# Altium project CPU-board-multi.PrjPCB (part 1 of 2)
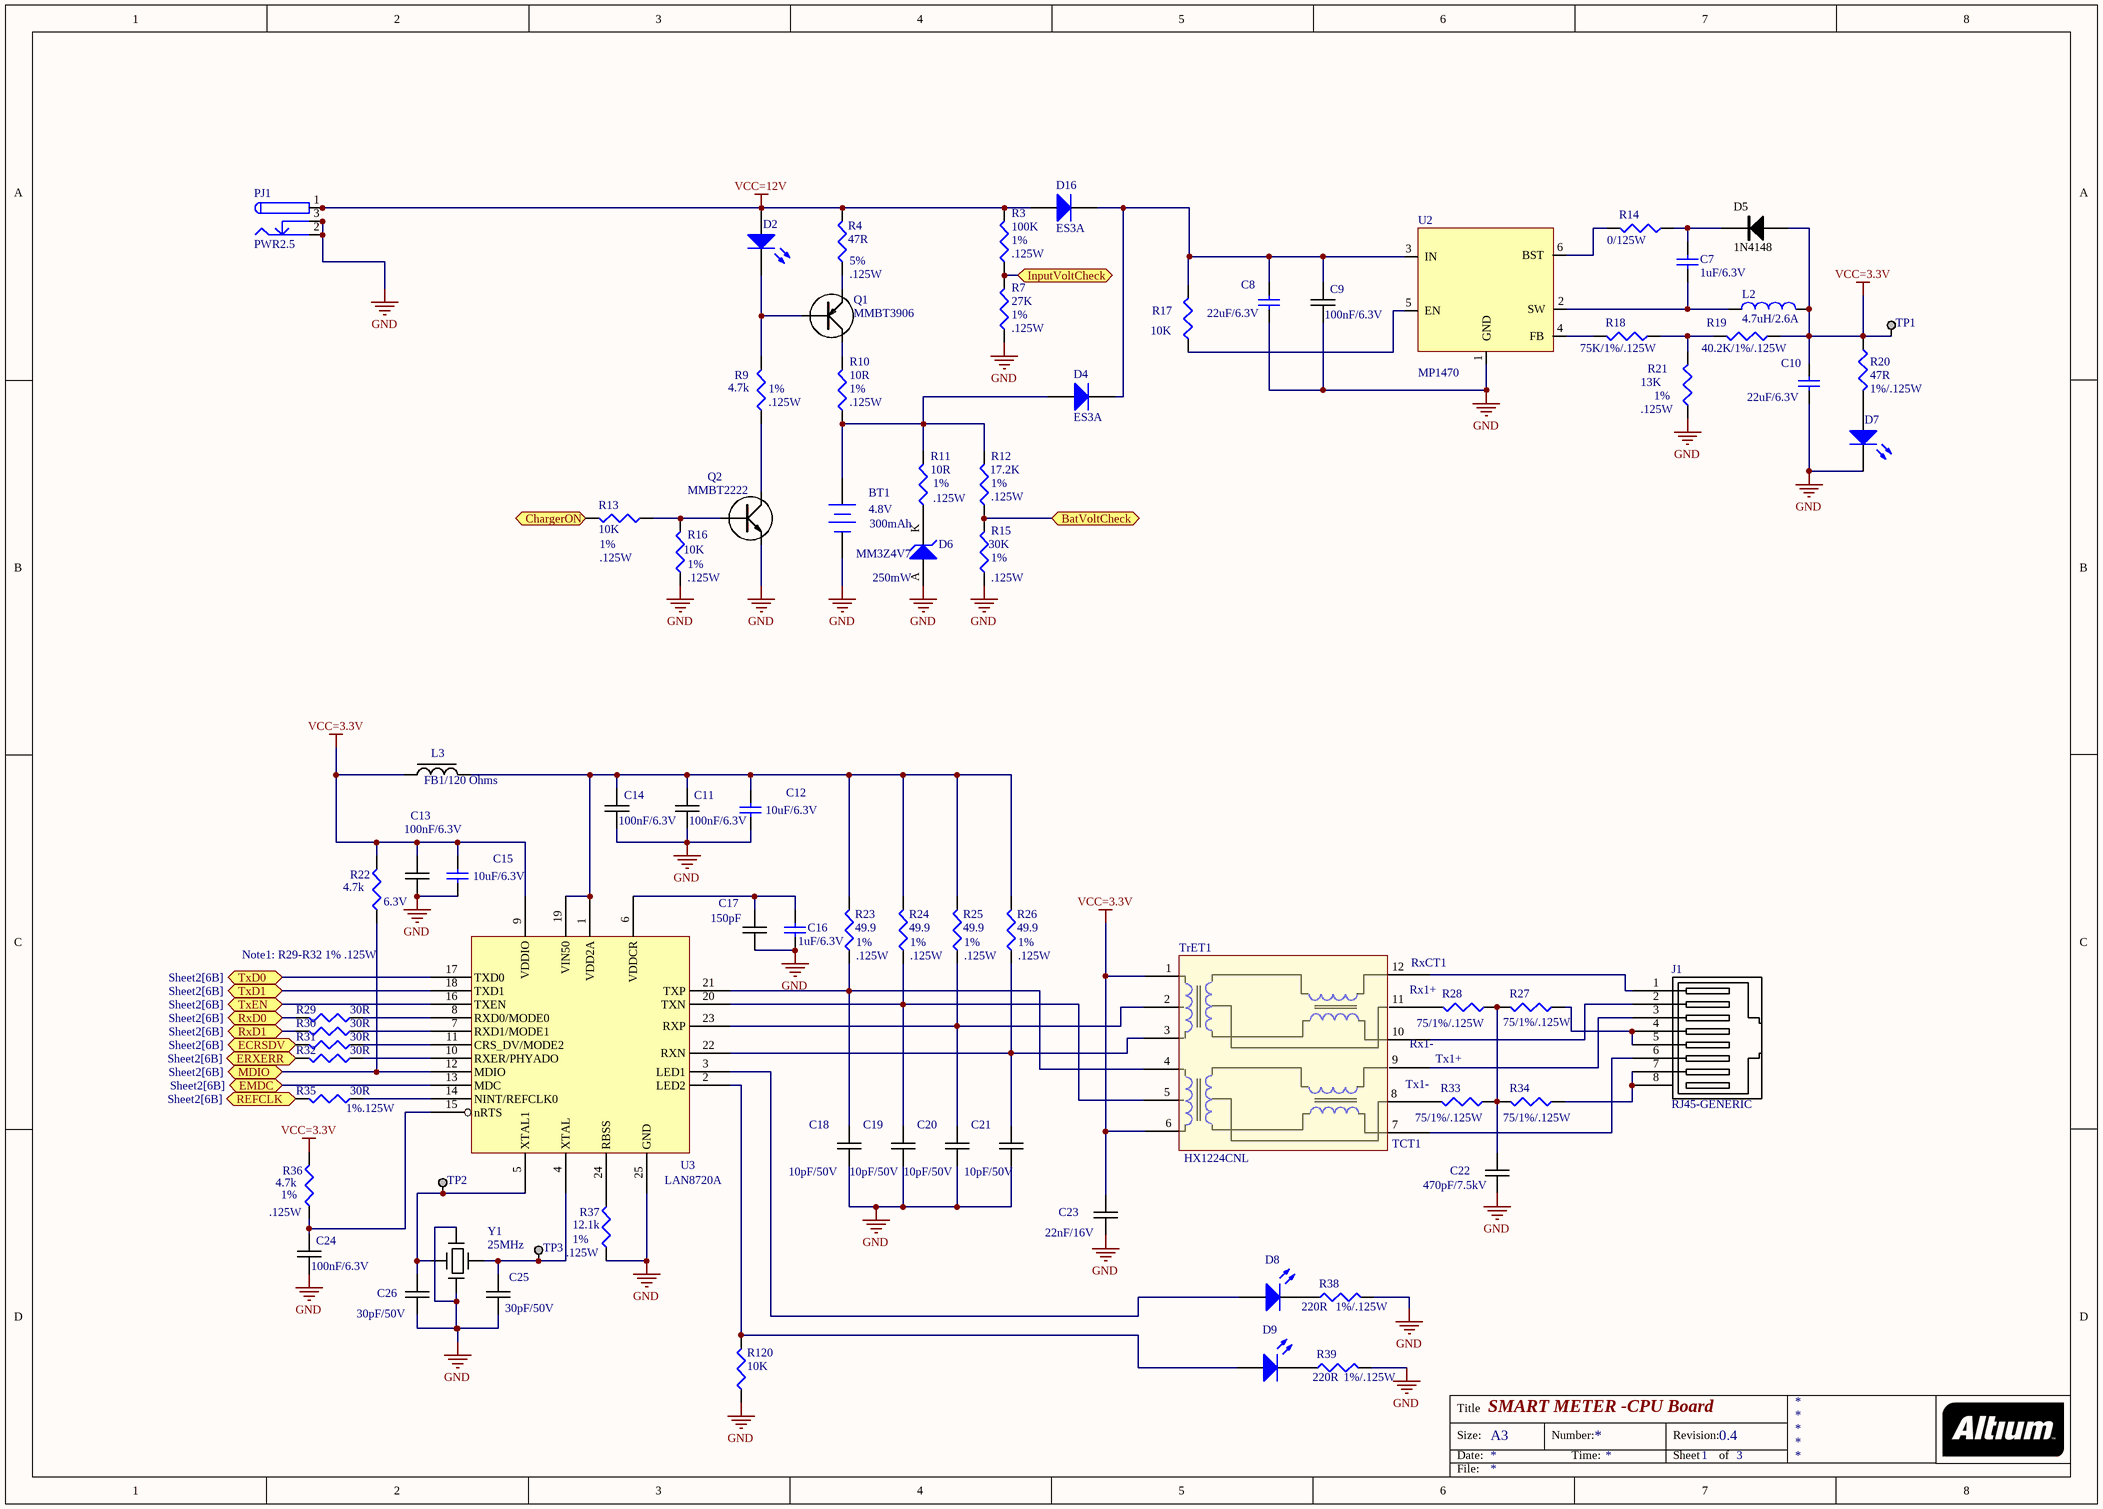
[diagram p0: CPU-board-Sheet1-multi.SchDoc]
3 sheets, 319 parts. Net scope: flat (ports and power ports of the same name join across sheets).
Board file: CPU-board-multi.PcbDoc
Sheets:
  CPU-board-Sheet1-multi.SchDoc
  CPU-board-Sheet2-multi.SchDoc
  CPU-board-Sheet3-multi.SchDoc

## Sheet CPU-board-Sheet1-multi.SchDoc: SMART METER -CPU Board
size A3; Revision: 0.4; SheetNumber: 1; SheetTotal: 3

### Parts
BT1  4.8V  [BAT-2]
C7  1uF/6.3V  [0402C-GENERIC]
C8  22uF/6.3V  [1206C-GENERIC]
C9  100nF/6.3V  [0402C-GENERIC]
C10  22uF/6.3V  [1206C-GENERIC]
C11  100nF/6.3V  [0402C-GENERIC]
C12  10uF/6.3V  [0402C-GENERIC]
C13  100nF/6.3V  [0402C-GENERIC]
C14  100nF/6.3V  [0402C-GENERIC]
C15  10uF/6.3V  [0402C-GENERIC]
C16  1uF/6.3V  [0402C-GENERIC]
C17  150pF  [0402C-GENERIC]
C18  10pF/50V  [0402C-GENERIC]
C19  10pF/50V  [0402C-GENERIC]
C20  10pF/50V  [0402C-GENERIC]
C21  10pF/50V  [0402C-GENERIC]
C22  470pF/7.5kV  [1808]
C23  22nF/16V  [0402C-GENERIC]
C24  100nF/6.3V  [0402C-GENERIC]
C25  30pF/50V  [0402C-GENERIC]
C26  30pF/50V  [0402C-GENERIC]
D2  LED2  [LED-SM]  (value not drawn)
D4  ES3A  [DO214AA]
D5  1N4148  [SOD-123]
D6  MM3Z4V7  [SOT23-DIODE]
D7  LED2  [LED-SM]  (value not drawn)
D8  LED2  [LED-SM]  (value not drawn)
D9  LED2  [LED-SM]  (value not drawn)
D16  ES3A  [DO214AA]
J1  RJ45-GENERIC  [RJ45-8/8]
L2  4.7uH/2.6A  [Inductor 4.7/6.8]
L3  FB1/120 Ohms  [0603C-2U2]
PJ1  PWR2.5  [Female Plug]
Q1  MMBT3906  [SOT23-BCE]
Q2  MMBT2222  [MMBT2222]
R3  100K  [0402R-TBD]
R4  47R  [0402R-TBD]
R7  27K  [0402R-TBD]
R9  4.7k  [0402R-TBD]
R10  10R  [0402R-TBD]
R11  10R  [0402R-TBD]
R12  17.2K  [0402R-TBD]
R13  10K  [0402R-TBD]
R14  0/125W  [0402C-GENERIC]
R15  30K  [0402R-TBD]
R16  10K  [0402R-TBD]
R17  10K  [0402R-TBD]
R18  75K/1%/.125W  [0402C-TBD]
R19  40.2K/1%/.125W  [0402R-TBD]
R20  47R  [0402R-TBD]
R21  13K  [0402R-TBD]
R22  4.7k  [0402R-TBD]
R23  49.9  [0402R-TBD]
R24  49.9  [0402R-TBD]
R25  49.9  [0402R-TBD]
R26  49.9  [0402R-TBD]
R27  75/1%/.125W  [0402R-TBD]
R28  75/1%/.125W  [0402R-TBD]
R29  30R  [0402R-TBD]
R30  30R  [0402R-TBD]
R31  30R  [0402R-TBD]
R32  30R  [0402R-TBD]
R33  75/1%/.125W  [0402R-TBD]
R34  75/1%/.125W  [0402R-TBD]
R35  30R  [0402R-TBD]
R36  4.7k  [0402R-TBD]
R37  12.1k  [0402R-TBD]
R38  220R  [0402R-TBD]
R39  220R  [0402R-TBD]
R120  10K  [0402R-TBD]
TP1  TESTPOINT  [TESTPOINT]  (value not drawn)
TP2  TESTPOINT  [TESTPOINT]  (value not drawn)
TP3  TESTPOINT  [TESTPOINT]  (value not drawn)
TrET1  HX1224CNL  [HX1224-NL]
U2  MP1470  [MP1470]
U3  LAN8720A  [QFN24_4X4_N]
Y1  25MHz  [CeramicResonator8-16MHZ]

### Ports
BatVoltCheck, ChargerON, ECRSDV (see Sheet2[6B]), EMDC (see Sheet2[6B]), ERXERR (see Sheet2[6B]), InputVoltCheck, MDIO (see Sheet2[6B]), REFCLK (see Sheet2[6B]), RxD0 (see Sheet2[6B]), RxD1 (see Sheet2[6B]), TxD0 (see Sheet2[6B]), TxD1 (see Sheet2[6B]), TxEN (see Sheet2[6B])

### Nets
GND: BT1.2(-) C8.2 C9.2 C10.2 C11.2 C12.2 C13.2 C14.2 C15.2 C16.1 C17.2 C18.2 C19.2 C20.2 C21.2 C22.2 C23.2 C24.2 C25.2 C26.2 D6.A D7.2(K) PJ1.2 PJ1.2A PJ1.2B PJ1.3 PJ1.3A PJ1.3B Q2.E R7.1 R15.1 R16.1 R21.1 R37.1 R38.2 R39.2 R120.1 U2.1(GND) U3.25(GND) Y1.2 Y1.4
VCC=3.3V: C10.1 C13.1 C15.1 C23.1 D5.A L2.2 L3.1 R19.1 R20.1 R22.2 R36.2 TP1.1 TrET1.1(TD+) TrET1.6 U3.9(VDDIO)
VCC=12V: D2.1(A) D16.1(A) PJ1.1 PJ1.1A PJ1.1B R3.2 R4.2
NetBT1_1: BT1.1(+) D4.1(A) R10.1 R11.2 R12.2
NetC7_1: C7.1 L2.1 U2.2(SW)
NetC7_2: C7.2 D5.K R14.1
NetC8_1: C8.1 C9.1 D4.2(K) D16.2(K) R17.2 U2.3(IN)
NetC11_1: C11.1 C12.1 C14.1 L3.2 R23.2 R24.2 R25.2 R26.2 U3.1(VDD2A) U3.19(VIN50)
NetC16_2: C16.2 C17.1 U3.6(VDDCR)
NetC18_1: C18.1 R23.1 TrET1.4 U3.21(TXP)
NetC19_1: C19.1 R24.1 TrET1.5 U3.20(TXN)
NetC20_1: C20.1 R25.1 TrET1.2(TDCT) U3.23(RXP)
NetC21_1: C21.1 R26.1 TrET1.3(TD-) U3.22(RXN)
NetC22_1: C22.1 R27.2 R28.1 R33.1 R34.2
NetC24_1: C24.1 R36.1 U3.15(nRTS)
NetC25_1: C25.1 TP3.1 U3.4(XTAL) Y1.1
NetC26_1: C26.1 TP2.1 U3.5(XTAL1) Y1.3
NetD2_2: D2.2(K) Q1.B R9.2
NetD6_K: D6.K R11.1
NetD7_1: D7.1(A) R20.2
NetD8_1: D8.1(A) U3.3(LED1)
NetD8_2: D8.2(K) R38.1
NetD9_1: D9.1(A) R120.2 U3.2(LED2)
NetD9_2: D9.2(K) R39.1
NetJ1_1: J1.1 TrET1.12
NetJ1_2: J1.2 TrET1.10
NetJ1_3: J1.3 TrET1.9
NetJ1_4: J1.4 J1.5 R27.1
NetJ1_6: J1.6 TrET1.7
NetJ1_7: J1.7 J1.8 R34.1
NetQ1_C: Q1.C R10.2
NetQ1_E: Q1.E R4.1
NetQ2_B: Q2.B R13.1 R16.2
NetQ2_C: Q2.C R9.1
NetR3_1: R3.1 R7.2 ; port InputVoltCheck
NetR12_1: R12.1 R15.2 ; port BatVoltCheck
NetR13_2: R13.2 ; port ChargerON
NetR14_2: R14.2 U2.6(BST)
NetR17_1: R17.1 U2.5(EN)
NetR18_1: R18.1 R19.2 R21.2
NetR18_2: R18.2 U2.4(FB)
NetR22_1: R22.1 U3.12(MDIO) ; port MDIO
NetR28_2: R28.2 TrET1.11
NetR29_1: R29.1 U3.8(RXD0/MODE0)
NetR29_2: R29.2 ; port RxD0
NetR30_1: R30.1 U3.7(RXD1/MODE1)
NetR30_2: R30.2 ; port RxD1
NetR31_1: R31.1 U3.11(CRS_DV/MODE2)
NetR31_2: R31.2 ; port ECRSDV
NetR32_1: R32.1 U3.10(RXER/PHYADO)
NetR32_2: R32.2 ; port ERXERR
NetR33_2: R33.2 TrET1.8
NetR35_1: R35.1 U3.14(NINT/REFCLK0)
NetR35_2: R35.2 ; port REFCLK
NetR37_2: R37.2 U3.24(RBSS)
NetU3_13: U3.13(MDC) ; port EMDC
NetU3_16: U3.16(TXEN) ; port TxEN
NetU3_17: U3.17(TXD0) ; port TxD0
NetU3_18: U3.18(TXD1) ; port TxD1

### Notes on the sheet
- (near R3) 1%
- (near R4) 5%
- (near R4) .125W
- (near R3) .125W
- (near R7) 1%
- (near R7) .125W
- (near R9) 1%
- (near R9) .125W
- (near R10) 1%
- (near R10) .125W
- (near R21) .125W
- (near R21) 1%
- (near R20) 1%/.125W
- (near R11) 1%
- (near R11) .125W
- (near R12) 1%
- (near R12) .125W
- (near R13) 1%
- .125W
- (near R16) 1%
- (near R16) .125W
- 300mAh
- (near D6) 250mW
- (near R15) 1%
- (near R15) .125W
- (near R22) 6.3V
- Note1: R29-R32 1% .125W
- (near R23) 1%
- (near R23) .125W
- (near R24) 1%
- (near R24) .125W
- (near R25) 1%
- (near R25) .125W
- (near R26) 1%
- (near R26) .125W
- Rx1+
- RxCT1
- Rx1-
- (near R35) 1%
- (near R35) .125W
- Tx1-
- Tx1+
- (near TrET1) TCT1
- (near R36) .125W
- (near R36) 1%
- (near R37) .125W
- 1%
- (near R38) 1%/.125W
- (near R39) 1%/.125W
- Title
- Size:
- Date:
- A3
- Number:
- Time:
- Revision:
- Sheet
- of
- File:

### Library data of the parts
BT1 = Battery: Multicell Battery; Manufacturer: Guangdong, China (Mainland); Mfr.PN#: 9V-NIMH-01; Published: 24-Mar-1999; LatestRevisionDate: 17-Jul-2002; LatestRevisionNote: Re-released for DXP Platform.; PackageReference: BAT-2; Publisher: sunbangpower.en.alibaba.com; PackageDescription: Battery; 2 Leads; Price: 1; Lik access: *
C7 C16 = Cap: Capacitor; Manufacturer: Murata; Mfr.PN#: GRM155R60J105KE19D; Value: 1uF; Suppl.PN#: 490-1320-1-ND; Published: 8-Jun-2000; LatestRevisionDate: 17-Jul-2002; LatestRevisionNote: Re-released for DXP Platform.; PackageReference: 0402; Publisher: Altium Limited; PackageDescription: Radial Cap, Thru-Hole; 2 Leads; 0.3 in Pin Spacing; Supplier: DigiKey
C8 C10 = Cap: Capacitor; Manufacturer: Murata; Mfr.PN#: GRM31CR60J226KE19L; Value: 100n; Suppl.PN#: 490-1824-2-ND; Published: 8-Jun-2000; LatestRevisionDate: 17-Jul-2002; LatestRevisionNote: Re-released for DXP Platform.; PackageReference: 1206; Publisher: Altium Limited; PackageDescription: Radial Cap, Thru-Hole; 2 Leads; 0.3 in Pin Spacing; Supplier: Digi-Key; Price: .049; Footprint: 0603
C9 C11 C13 C14 C24 = 0805C-18PF-50V-C0G-JOH: CAPACITOR 0805 CERAMIC; mfr PN: LMK105BJ104KV-F; Manufacturer: Taiyo Yuden; Mfr.PN#: CRM155R71H103KA880; Value: 100nF/16V; Suppl.PN#: 587-1227-1-ND; Supplier 1: Digi-Key; Supplier Part Number 1: 709-1171-2-ND; Package reference: 0805-TBD; Supplier: Digi-Key; PackageReference: 0402; Price: .002
C12 C15 = Cap: Capacitor; Manufacturer: Murata; Mfr.PN#: GRM155R60J106ME15D; Suppl.PN#: 490-13238-6-ND; Published: 8-Jun-2000; LatestRevisionDate: 17-Jul-2002; LatestRevisionNote: Re-released for DXP Platform.; PackageReference: 0402; Publisher: Altium Limited; PackageDescription: Radial Cap, Thru-Hole; 2 Leads; 0.3 in Pin Spacing; Value: 10uF/6.3V; Supplier: Digi-Key; Price: .049; Footprint: 0603
C17 = 0805C-18PF-50V-C0G-JOH: CAPACITOR 0805 CERAMIC; Manufacturer: Wurth Electronics; Mfr.PN#: 885012005014; Value: 150pF/10V; Suppl.PN#: 732-7432-1-ND; Supplier 1: Digi-Key; Supplier Part Number 1: 709-1171-2-ND; mfr PN: *; PackageReference: 0402; Supplier: Digi-Key; smd: 0402; Price: .002
C18-C21 = 0805C-18PF-50V-C0G-JOH: CAPACITOR 0805 CERAMIC; Manufacturer: Murata; Mfr.PN#: GRM1555C1H100FA01D; Suppl.PN#: 490-6186-1-ND; Supplier 1: Digi-Key; Supplier Part Number 1: 709-1171-2-ND; Value: 10pF/50V; Supplier: Digi-Key; Price: .03; PackageReference: 0402
C22 = 0805C-18PF-50V-C0G-JOH: CAPACITOR 1808CERAMIC; Manufacturer: Murata; Mfr.PN#: DHRB5AD471M1CB; Value: 470pF; Suppl.PN#: 81-DHRB5AD471M1CB; Supplier 1: Digi-Key; Supplier Part Number 1: 709-1171-2-ND; Supplier: Mouser; PackageReference: 1801; Price: .0096
C23 = 0805C-18PF-50V-C0G-JOH: CAPACITOR 0805 CERAMIC; Manufacturer: Murata Electronics; Mfr.PN#: GRM155R71H223KA12D; Value: 22nF; Suppl.PN#: 490-3884-1-ND; Supplier 1: Digi-Key; Supplier Part Number 1: 709-1171-2-ND; Supplier: 490-5407-6-ND; SMD: 0402; Price: .0096; PackageReference: 0402
C25 C26 = 0805C-18PF-50V-C0G-JOH: CAPACITOR 0805 CERAMIC; Manufacturer: Murata; Mfr.PN#: C0402C300J5GACTU; Suppl.PN#: 399-7785-1-ND; Supplier 1: Digi-Key; Supplier Part Number 1: 709-1171-2-ND; Value: 30pF/50V; Supplier: KEMET; Price: $ 0.34; PackageReference: 0402
D2 D7-D9 = LED2: Typical RED, GREEN, YELLOW, AMBER GaAs LED; Manufacturer: Lite-On Inc; Mfr.PN#: LTST-C191KGKT; Suppl.PN#: 160-1446-2-ND; Published: 8-Jun-2000; LatestRevisionDate: 17-Jul-2002; LatestRevisionNote: Re-released for DXP Platform.; PackageVersion: Feb-2002; PackageReference: 0603; Publisher: Altium Limited; PackageDescription: SM LED; 2 Flat Leads; Supplier: Digi-Key; Price: .04
D4 D16 = Diode 1N4007: 1 Amp General Purpose Rectifier; Manufacturer: Fairchild Co; Suppl.PN#: ES3AFSCT-ND; Published: 8-Jun-2000; LatestRevisionDate: 17-Jul-2002; LatestRevisionNote: Re-released for DXP Platform.; DatasheetVersion: 1998; PackageVersion: Aug-1999; PackageReference: DO-214AC; Publisher: Altium Limited; PackageDescription: Diode, Axial; Body 5.2 x 2.7 mm (LxDia. max), Lead Dia. 0.86 mm (max); Code_JEDEC: DO-204-AL; ComponentLink1Description: Manufacturer Link; ComponentLink1URL: http://www.fairchildsemi.com/; ComponentLink2Description: Datasheet; ComponentLink2URL: http://www.fairchildsemi.com/ds/1N%2F1N4001.pdf; Mfr.PN#: ES3A; Supplier: DigiKey; Price: .142
D5 = 1N4001: Manufacturer: Vishay; Mfr.PN#: 1N4148W-E3-18; Suppl.PN#: 1N4148W-E3-18CT-ND; Supplier: Digikey; PackageReference: SOD-123
D6 = D Zener: Zener Diode; Manufacturer: Fairchild Semi; Mfr.PN#: MM3Z4V7B; Suppl.PN#: MM3Z4V7BCT-ND; Published: 8-Jun-2000; LatestRevisionDate: 17-Jul-2002; LatestRevisionNote: Re-released for DXP Platform.; PackageReference: SOD-323F; Publisher: Altium Limited; PackageDescription: Diode, Thru-Hole; 2 Leads; 0.7 in Pin Spacing; Supplier: DigiKey
J1 = RJ45-GENERIC: GENERIC RJ45 CONNECTOR 8 PIN; Manufacturer: Assman WSW Components; Mfr.PN#: A-2004-2-4-LP-N-R; Suppl.PN#: AE10384-ND; Supplier: DigiKey
L2 = Inductor: Manufacturer: Bourns; Mfr.PN#: SDR7045-6R8M; Code_IEC: 1005; Value: 4.7uH; Suppl.PN#: 490-10791-1-ND; Published: 8-Jun-2000; LatestRevisionDate: 29-May-2009; LatestRevisionNote: IPC-7351 Footprint Added.; PackageReference: 2-SMD; Publisher: Altium Limited; PackageDescription: Chip Inductor; Code_JEITA: 0402; mfr PN: *; Supplier: DigiKey; Price: .82
L3 = 1U-1239AS-TOKO: 1239AS-H-1R0N; Mfr.PN#: BLM18PG121SN1D; Manufacturer: Murata Electronics; Suppl.PN#: 490-1037-1-ND; Supplier: Digi-Key; Price: .288; SMD: look at dsheet; PackageReference: 0603
PJ1 = PWR2.5: Low Voltage Power Supply Connector; Manufacturer: CUI Inc; Mfr.PN#: PJ1-022-SMT-TR; Suppl.PN#: CP1-022PJCT-ND; Published: 17-Dec-2003; DatasheetDocument: 09-May-2002; Publisher: Altium Limited; ComponentLink1Description: Manufacturer Link; ComponentLink1URL: http://domino.kycon.com/internet/Products.html; Supplier: Digikey; Link: http://www.digikey.bg/product-detail/en/cui-inc/PJ1-022-SMT-TR/CP1-022PJCT-ND/659939
Q1 = PNP-GENERIC: GENERIC PNP BIPOLAR TRANSISTOR; Manufacturer: On Semi; Mfr.PN#: MMBT3906LT1G; Suppl.PN#: MMBT3906LT1GOSCT-ND; MMBT3906LT1GOSCT-ND: SOT23-3; Supplier: DigiKey; PackageReference: SOT23-3
Q2 = MMBT2222: BC847 SMALL SIGNAL NPN TRANSISTOR; Manufacturer: Diodes  Inc.; Mfr.PN#: MMBT2222A-7-F; Suppl.PN#: MMBT2222A-FDICT-ND; Supplier 1: Digi-Key; Supplier: Digi-Key; PackageReference: SOT-323; Price: .03
R3 = Res3: Resistor; Manufacturer: Panasonic; Mfr.PN#: ERJ-2RKF1003X; Suppl.PN#: P100KLCT-ND; Published: 8-Jun-2000; LatestRevisionDate: 29-May-2009; LatestRevisionNote: IPC-7351 Footprint Added.; PackageReference: 0402; Publisher: Altium Limited; PackageDescription: Chip Resistor; Value: 100K; Supplier: DigiKey; Price: .0035
R4 = Res3: Resistor; mfr PN: ERJ-2RKF47R0X; Manufacrturer: Panasonic; Mfr.PN#: CRCW080545R0FKTA; Value: 45/.125/1%; Suppl.PN#: P47.0LCT-ND; Published: 8-Jun-2000; LatestRevisionDate: 29-May-2009; LatestRevisionNote: IPC-7351 Footprint Added.; PackageReference: 0402; Publisher: Altium Limited; PackageDescription: Chip Resistor; Supplier: Digi-Key
R7 = Res3: Resistor; Manufacturer: Panasonic; Mfr.PN#: ERJ-2RKF2702X; Suppl.PN#: P27.0KLDKR-ND; Published: 8-Jun-2000; LatestRevisionDate: 29-May-2009; LatestRevisionNote: IPC-7351 Footprint Added.; PackageReference: 0402; Publisher: Altium Limited; PackageDescription: Chip Resistor; Value: 27K; Supplier: DigiKey; Price: .0035
R9 R22 R36 = Res3: Resistor; Manufacturer: Panasonic; Mfr.PN#: ERJ-2RKF4701X; Value: 4.7k/ .125W 1%; Suppl.PN#: P4.70KLCT-ND; Published: 8-Jun-2000; LatestRevisionDate: 29-May-2009; LatestRevisionNote: IPC-7351 Footprint Added.; PackageReference: 0402; Publisher: Altium Limited; PackageDescription: Chip Resistor; Supplier: Digi-Key; Price: .1
R10 R11 = Res3: Resistor; Manufacturer: Panasonic; Mfr.PN#: ERJ-2RKF10R0X; Suppl.PN#: P10.0LDKR-ND; Published: 8-Jun-2000; LatestRevisionDate: 29-May-2009; LatestRevisionNote: IPC-7351 Footprint Added.; PackageReference: 0402; Publisher: Altium Limited; PackageDescription: Chip Resistor; Value: 10R; Supplier: DigiKey; Price: .0035
R12 = Res3: Resistor; Manufacturer: Vishay Dale; Mfr.PN#: TNPW040217K2BEED; Value: 57.6K; Suppl.PN#: 541-2080-2-ND; Published: 8-Jun-2000; LatestRevisionDate: 29-May-2009; LatestRevisionNote: IPC-7351 Footprint Added.; PackageReference: 0402; Publisher: Altium Limited; PackageDescription: Chip Resistor; Supplier: DigiKey; Price: .0035
R13 R16 R17 = Res3: Resistor; Manufacturer: Panasonic; Mfr.PN#: ERJ-2RKF1002X; Value: 100K; Suppl.PN#: P10.0KLTR-ND; Published: 8-Jun-2000; LatestRevisionDate: 29-May-2009; LatestRevisionNote: IPC-7351 Footprint Added.; PackageReference: 0402; Publisher: Altium Limited; PackageDescription: Chip Resistor; Supplier: Digi-Key; Price: .0035
R14 = Res3: Resistor; Manufacturer: Vishay Dale; Mfr.PN#: RCA0805100KFKEA; Value: 100K; Suppl.PN#: 541-2230-1-ND; Published: 8-Jun-2000; LatestRevisionDate: 29-May-2009; LatestRevisionNote: IPC-7351 Footprint Added.; PackageReference: 0402; Publisher: Altium Limited; PackageDescription: Chip Resistor; Supplier: Digi-Key; Price: .0035
R15 = Res3: Resistor; Manufacturer: Panasonic; Mfr.PN#: ERJ-2RKF3002X; Value: 33K; Published: 8-Jun-2000; LatestRevisionDate: 29-May-2009; LatestRevisionNote: IPC-7351 Footprint Added.; PackageReference: 0402; Publisher: Altium Limited; PackageDescription: Chip Resistor; Supplier: DigiKey; Price: .0035
R18 = Res3: Resistor; Manufacturer: Panasonic; Mfr.PN#: ERJ-2GEJ753X; Value: 75K; Suppl.PN#: P75KJDKR-ND; Published: 8-Jun-2000; LatestRevisionDate: 29-May-2009; LatestRevisionNote: IPC-7351 Footprint Added.; PackageReference: 0402; Publisher: Altium Limited; PackageDescription: Chip Resistor; Supplier: Digikey; Price: .0035
R19 = Res3: Resistor; Manufacturer: Panasonic; Mfr.PN#: ERJ-2RKF4022X; Value: 100K; Suppl.PN#: P40.2KLCT-ND; Published: 8-Jun-2000; LatestRevisionDate: 29-May-2009; LatestRevisionNote: IPC-7351 Footprint Added.; PackageReference: 0402; Publisher: Altium Limited; PackageDescription: Chip Resistor; Supplier: DigiKey; Price: .0035
R20 = Res3: Resistor; mfr PN: ERJ-2RKF47R0X; Manufacrturer: Panasonic; Mfr.PN#: ERJ-6ENF47R0V; Value: 45/.125/1%; Suppl.PN#: P47.0LCT-ND; Published: 8-Jun-2000; LatestRevisionDate: 29-May-2009; LatestRevisionNote: IPC-7351 Footprint Added.; PackageReference: 0402; Publisher: Altium Limited; PackageDescription: Chip Resistor; Supplier: Digi-Key
R21 = Res3: Resistor; Manufacturer: Panasonic; Mfr.PN#: ERJ-2RKF1302X; Suppl.PN#: P13.0KLCT-ND; Published: 8-Jun-2000; LatestRevisionDate: 29-May-2009; LatestRevisionNote: IPC-7351 Footprint Added.; PackageReference: 0402; Publisher: Altium Limited; PackageDescription: Chip Resistor; Value: 13K; Supplier: DigiKey; Price: .0035
R23-R26 = Res3: Resistor; Manufacturer: Panasonic; Mfr.PN#: ERJ-2RKF49R9X; Value: 49.9 .125W 1%; Suppl.PN#: P49.9LCT-ND; Published: 8-Jun-2000; LatestRevisionDate: 29-May-2009; LatestRevisionNote: IPC-7351 Footprint Added.; PackageReference: 0402; Publisher: Altium Limited; PackageDescription: Chip Resistor; Supplier: Digi-Key; Price: .0026
R27 R28 R33 R34 = Res3: Resistor; Manufacturer: Panasonic; Mfr.PN#: ERJ-2RKF75R0X; Value: 75 1% .125; Suppl.PN#: P75.0LCT-ND; Published: 8-Jun-2000; LatestRevisionDate: 29-May-2009; LatestRevisionNote: IPC-7351 Footprint Added.; PackageReference: 0402; Publisher: Altium Limited; PackageDescription: Chip Resistor; Supplier: Digi-Key; Price: .0026
R29-R32 R35 = Res3: Resistor; Manufacturer: Panasonic; Mfr.PN#: ERJ-2RKF30R0X; Value: 100 .125W 1%; Suppl.PN#: P30.0LCT-ND; Published: 8-Jun-2000; LatestRevisionDate: 29-May-2009; LatestRevisionNote: IPC-7351 Footprint Added.; PackageReference: 0402; Publisher: Altium Limited; PackageDescription: Chip Resistor; Supplier: Digi-Key; Price: .1
R37 = Res3: Resistor; Manufacturer: Panasonic; Mfr.PN#: ERJ-2RKF1212X; Value: 12.1k/ .125W 1%; Suppl.PN#: P12.1KLCT-ND; Published: 8-Jun-2000; LatestRevisionDate: 29-May-2009; LatestRevisionNote: IPC-7351 Footprint Added.; PackageReference: 0402; Publisher: Altium Limited; PackageDescription: Chip Resistor; Supplier: Digi-Key; Price: .1
R38 R39 = Res3: Resistor; Manufacturer: Panasonic; Mfr.PN#: ERJ-2RKF1001X; Value: 1K; Suppl.PN#: P1.00KLCT-ND; Published: 8-Jun-2000; LatestRevisionDate: 29-May-2009; LatestRevisionNote: IPC-7351 Footprint Added.; PackageReference: 0402; Publisher: Altium Limited; PackageDescription: Chip Resistor; Supplier: DigiKey; Price: .0035
R120 = Res3: Resistor; Manufacturer: Panasonic; Mfr.PN#: ERJ-2GEJ103X; Value: 10K .125W 1%; Suppl.PN#: P10KJCT-ND; Published: 8-Jun-2000; LatestRevisionDate: 29-May-2009; LatestRevisionNote: IPC-7351 Footprint Added.; PackageReference: 0402; Publisher: Altium Limited; PackageDescription: Chip Resistor; Supplier: Digi-Key; Price: .0026
TP1-TP3 = TESTPOINT: TESTPOINT SCOPE GRABBER; Manufacturer Part Number: 5010; Manufacturer: Keystone Electronics; Reel: TH; Supplier 1: Digi-Key; Supplier Part Number 1: 5010K-ND
TrET1 = hx1224nl: Manufacturer: Pulse Electronic Corporation; Suppl.PN#: HX1224CNL-ND; Mfr.PN#: HX1224CNL; Supplier: DigiKey
U2 = MP1470: Manufacturer: MPS Inc; Mfr.PN#: MP1470GJ-P; Suppl.PN#: 1589-1018-1-ND; Supplier: DigiKey; PackageReference: TSOT-23-6
U3 = LAN8720: Manufacturer: Microchip; Mfr.PN#: LAN8720A-CP-TR; Suppl.PN#: LAN8720A-CP-CT-ND; Supplier: Digi-key; Price: .76; PackageReference: 24 QFN
Y1 = 12MC-HC49US-7MM: 25MHz CRYSTAL HC49US SHORT BODY; Manufacturer: KDS DAISHINKU.Corp; Mfr.PN#: DSX321SH-25MHz; Supplier 1: Mouser; Supplier Part Number 1: 520-120-20-3XT; Link access: www.kds.info/product; Supplier: KDS DAISHINKU.Corp; Suppl.PN#: DSX321SH-25MHz

## Sheet CPU-board-Sheet2-multi.SchDoc: SM-CPU Board
size A3; Revision: rev. 0.1; SheetNumber: 2
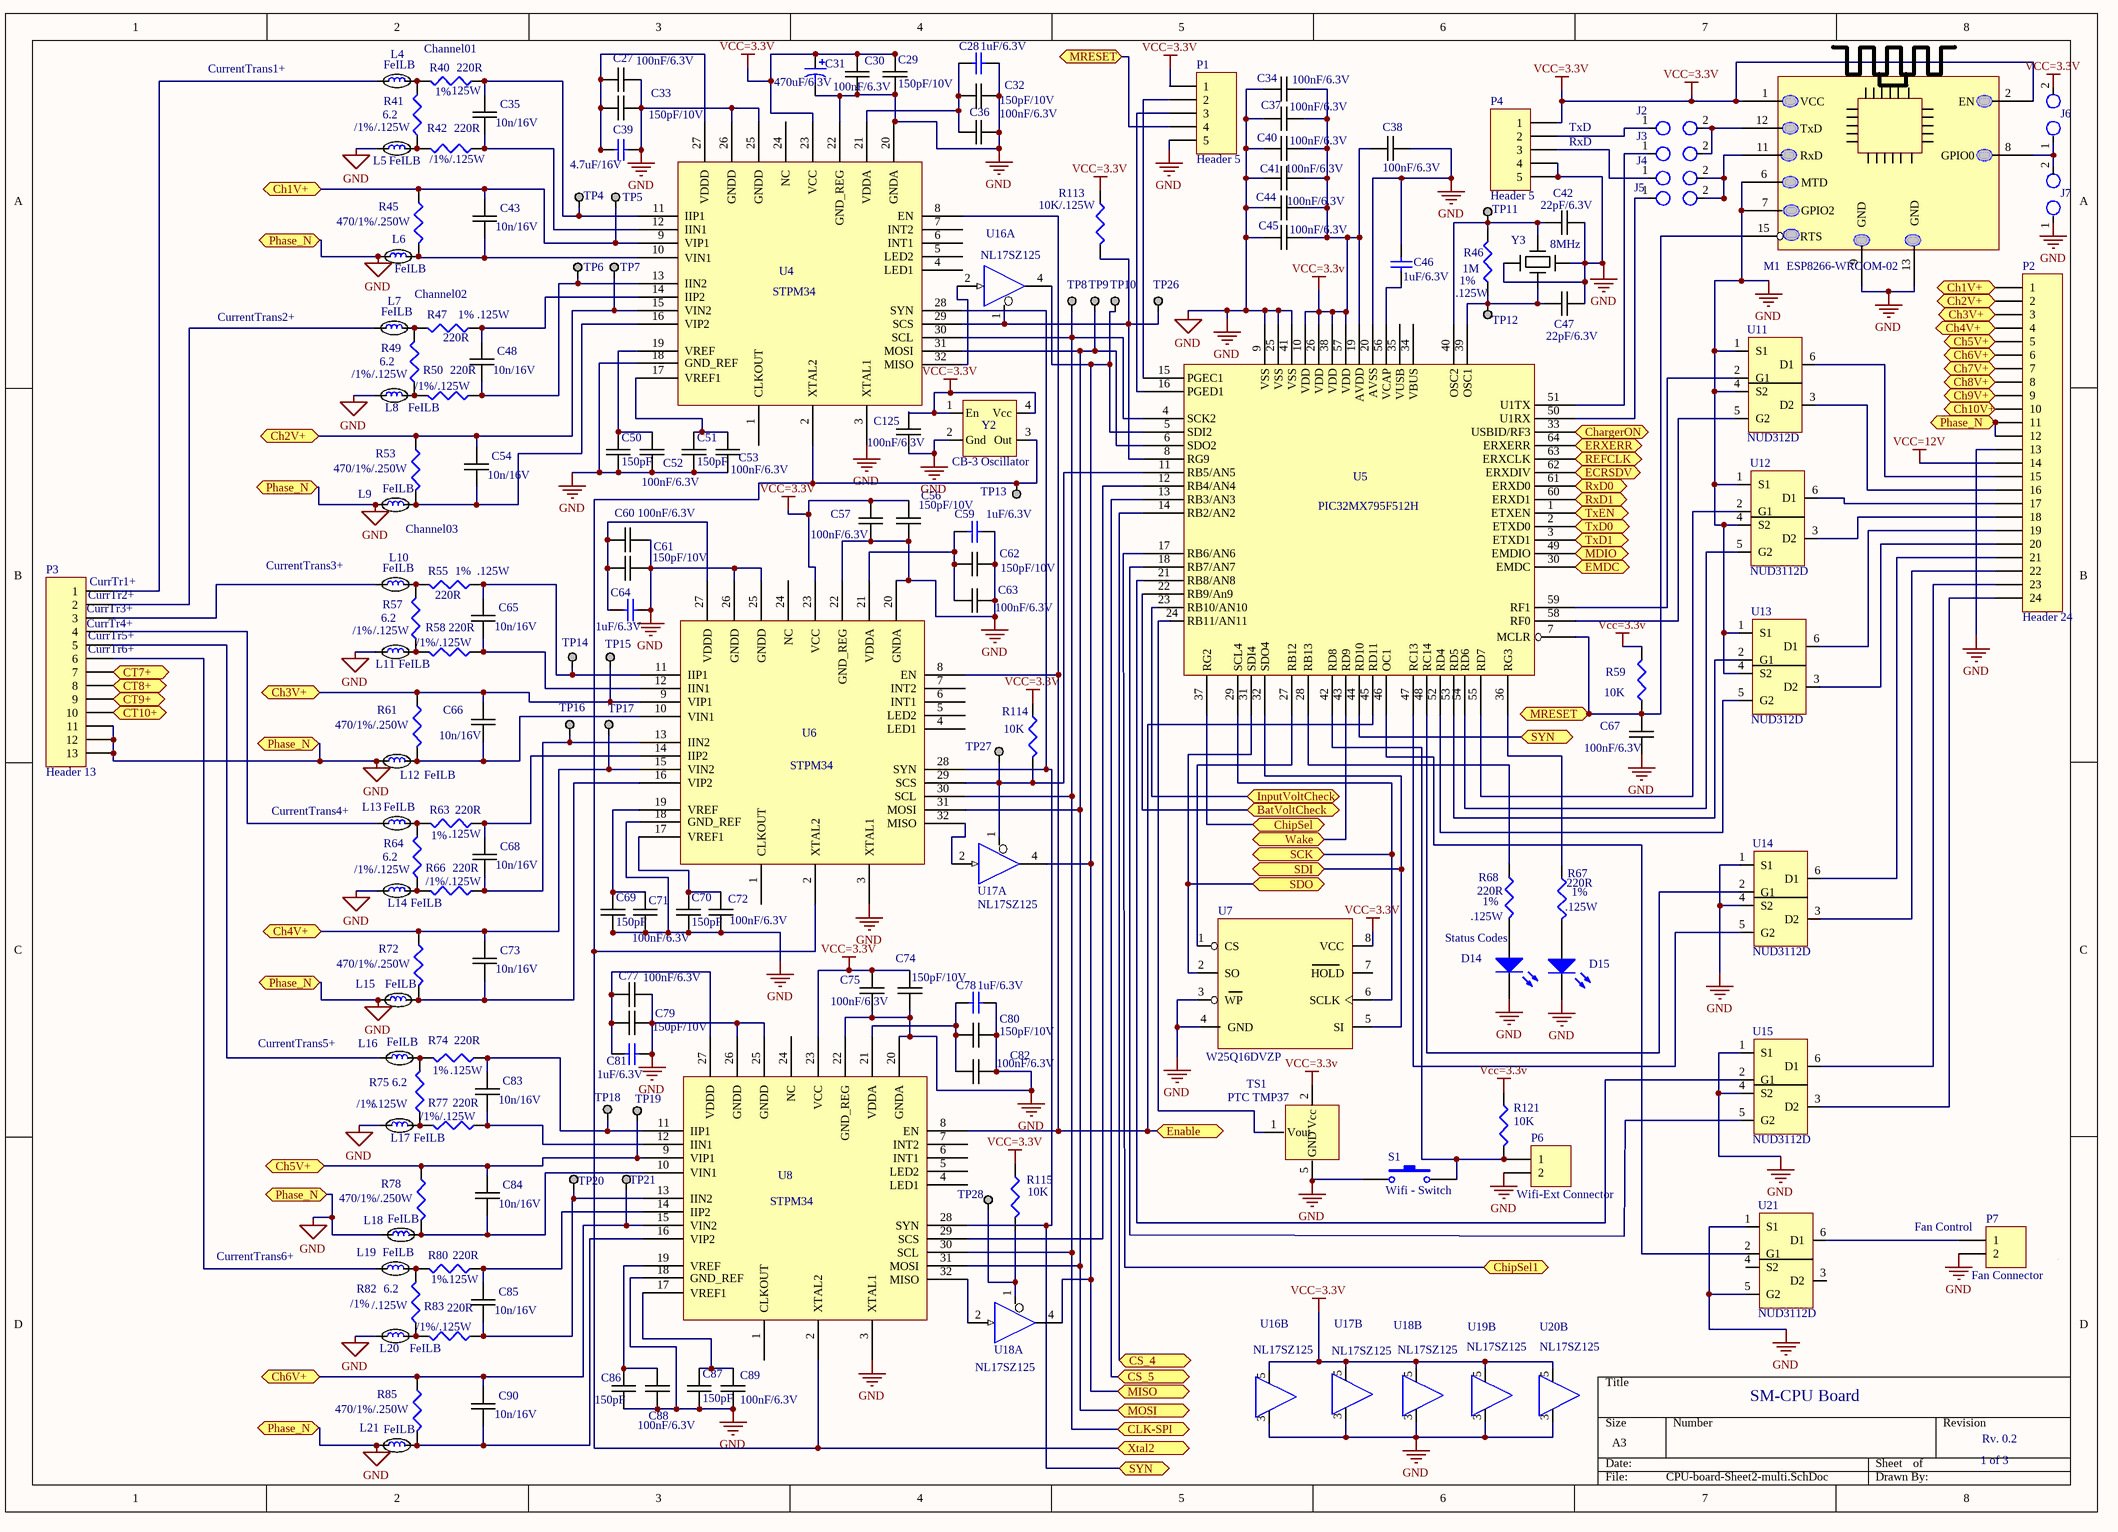
[diagram p1: CPU-board-Sheet2-multi.SchDoc]

### Parts
(Parts that share a designator on the sheet are numbered #1, #2 ... from top to bottom, then left to right.)
C27  100nF/6.3V  [0402C-GENERIC]
C28  1uF/6.3V  [0402C-GENERIC]
C29  150pF/10V  [0402C-GENERIC]
C30  100nF/6.3V  [0402C-GENERIC]
C31  470uF/6.3V  [470uF/6.3v]
C32  150pF/10V  [0402C-GENERIC]
C33  150pF/10V  [0402C-GENERIC]
C34  100nF/6.3V  [0402C-GENERIC]
C35  10n/16V  [0402C-GENERIC]
C36  100nF/6.3V  [0402C-GENERIC]
C37  100nF/6.3V  [0402C-GENERIC]
C38  100nF/6.3V  [0402C-GENERIC]
C39  4.7uF/16V  [0402C-GENERIC]
C40  100nF/6.3V  [0402C-GENERIC]
C41  100nF/6.3V  [0402C-GENERIC]
C42  22pF/6.3V  [0402C-GENERIC]
C43  10n/16V  [0402C-GENERIC]
C44  100nF/6.3V  [0402C-GENERIC]
C45  100nF/6.3V  [0402C-GENERIC]
C46  1uF/6.3V  [0402C-GENERIC]
C47  22pF/6.3V  [0402C-GENERIC]
C48  10n/16V  [0402C-GENERIC]
C50  150pF  [0402C-GENERIC]
C51  150pF  [0402C-GENERIC]
C52  100nF/6.3V  [0402C-GENERIC]
C53  100nF/6.3V  [0402C-GENERIC]
C54  10n/16V  [0402C-GENERIC]
C56  150pF/10V  [0402C-GENERIC]
C57  100nF/6.3V  [0402C-GENERIC]
C59  1uF/6.3V  [0402C-GENERIC]
C60  100nF/6.3V  [0402C-GENERIC]
C61  150pF/10V  [0402C-GENERIC]
C62  150pF/10V  [0402C-GENERIC]
C63  100nF/6.3V  [0402C-GENERIC]
C64  1uF/6.3V  [0402C-GENERIC]
C65  10n/16V  [0402C-GENERIC]
C66  10n/16V  [0402C-GENERIC]
C67  100nF/6.3V  [0402C-GENERIC]
C68  10n/16V  [0402C-GENERIC]
C69  150pF  [0402C-GENERIC]
C70  150pF  [0402C-GENERIC]
C71  100nF/6.3V  [0402C-GENERIC]
C72  100nF/6.3V  [0402C-GENERIC]
C73  10n/16V  [0402C-GENERIC]
C74  150pF/10V  [0402C-GENERIC]
C75  100nF/6.3V  [0402C-GENERIC]
C77  100nF/6.3V  [0402C-GENERIC]
C78  1uF/6.3V  [0402C-GENERIC]
C79  150pF/10V  [0402C-GENERIC]
C80  150pF/10V  [0402C-GENERIC]
C81  1uF/6.3V  [0402C-GENERIC]
C82  100nF/6.3V  [0402C-GENERIC]
C83  10n/16V  [0402C-GENERIC]
C84  10n/16V  [0402C-GENERIC]
C85  10n/16V  [0402C-GENERIC]
C86  150pF  [0402C-GENERIC]
C87  150pF  [0402C-GENERIC]
C88  100nF/6.3V  [0402C-GENERIC]
C89  100nF/6.3V  [0402C-GENERIC]
C90  10n/16V  [0402C-GENERIC]
C125  100nF/6.3V  [0402C-GENERIC]
D14  LED2  [LED-SM]  (value not drawn)
D15  LED2  [LED-SM]  (value not drawn)
J2  Header1x1  [HDR1X2]  (value not drawn)
J3  Header1x1  [HDR1X2]  (value not drawn)
J4  Header1x1  [HDR1X2]  (value not drawn)
J5  Header1x1  [HDR1X2]  (value not drawn)
J6  Header1x1  [HDR1X2]  (value not drawn)
J7  Header1x1  [HDR1X2]  (value not drawn)
L4  FeILB  [0603C-TBD]
L5  FeILB  [0603C-TBD]
L6  FeILB  [0603C-TBD]
L7  FeILB  [0603C-TBD]
L8  FeILB  [0603C-TBD]
L9  FeILB  [0603C-TBD]
L10  FeILB  [0603C-TBD]
L11  FeILB  [0603C-TBD]
L12  FeILB  [0603C-TBD]
L13  FeILB  [0603C-TBD]
L14  FeILB  [0603C-TBD]
L15  FeILB  [0603C-TBD]
L16  FeILB  [0603C-TBD]
L17  FeILB  [0603C-TBD]
L18  FeILB  [0603C-TBD]
L19  FeILB  [0603C-TBD]
L20  FeILB  [0603C-TBD]
L21  FeILB  [0603C-TBD]
M1  ESP8266-WROOM-02  [PCBComponent_1 - duplicate]
P1  Header 5  [HDR1X5]
P2  Header 24  [HDR1X24]
P3  Header 13
P4  Header 5  [HDR1X5]
P6  Wifi-Ext Connector  [HDR1X2]
P7  Fan Connector  [HDR1X2]
R40  220R  [0402R-TBD]
R41  6.2  [0402R-TBD]
R42  220R  [0402R-TBD]
R45  470/1%/.250W  [1206FB-GENERIC]
R46  1M  [0402R-TBD]
R47  220R  [0402R-TBD]
R49  6.2  [0402R-TBD]
R50  220R  [0402R-TBD]
R53  470/1%/.250W  [1206FB-GENERIC]
R55  220R  [0402R-TBD]
R57  6.2  [0402R-TBD]
R58  220R  [0402R-TBD]
R59  10K  [0402R-TBD]
R61  470/1%/.250W  [1206FB-GENERIC]
R63  220R  [0402R-TBD]
R64  6.2  [0402R-TBD]
R66  220R  [0402R-TBD]
R67  220R  [0402R-TBD]
R68  220R  [0402R-TBD]
R72  470/1%/.250W  [1206FB-GENERIC]
R74  220R  [0402R-TBD]
R75  6.2  [0402R-TBD]
R77  220R  [0402R-TBD]
R78  470/1%/.250W  [1206FB-GENERIC]
R80  220R  [0402R-TBD]
R82  6.2  [0402R-TBD]
R83  220R  [0402R-TBD]
R85  470/1%/.250W  [1206FB-GENERIC]
R113  10K/.125W  [0402C-GENERIC]
R114  10K  [0402C-GENERIC]
R115  10K  [0402C-GENERIC]
R121  10K  [0402R-TBD]
S1  Wifi - Switch  [SPST-2]
TP4  TESTPOINT  [TESTPOINT]  (value not drawn)
TP5  TESTPOINT  [TESTPOINT]  (value not drawn)
TP6  TESTPOINT  [TESTPOINT]  (value not drawn)
TP7  TESTPOINT  [TESTPOINT]  (value not drawn)
TP8  TESTPOINT  [TESTPOINT]  (value not drawn)
TP9  TESTPOINT  [TESTPOINT]  (value not drawn)
TP10  TESTPOINT  [TESTPOINT]  (value not drawn)
TP11#1  TESTPOINT  [TESTPOINT]  (value not drawn)
TP12  TESTPOINT  [TESTPOINT]  (value not drawn)
TP13  TESTPOINT  [TESTPOINT]  (value not drawn)
TP14  TESTPOINT  [TESTPOINT]  (value not drawn)
TP15  TESTPOINT  [TESTPOINT]  (value not drawn)
TP16  TESTPOINT  [TESTPOINT]  (value not drawn)
TP17#1  TESTPOINT  [TESTPOINT]  (value not drawn)
TP18  TESTPOINT  [TESTPOINT]  (value not drawn)
TP19  TESTPOINT  [TESTPOINT]  (value not drawn)
TP20  TESTPOINT  [TESTPOINT]  (value not drawn)
TP21#1  TESTPOINT  [TESTPOINT]  (value not drawn)
TP26  TESTPOINT  [TESTPOINT]  (value not drawn)
TP27  TESTPOINT  [TESTPOINT]  (value not drawn)
TP28  TESTPOINT  [TESTPOINT]  (value not drawn)
TS1  PTC TMP37
U4  STPM34  [QFN32_L]
U5  PIC32MX795F512H  [QFN64_N]
U6  STPM34  [QFN32_L]
U7  W25Q16DVZP  [SO8_L]
U8  STPM34  [QFN32_L]
U11  NUD312D  [NUD3112D]
U12  NUD3112D  [NUD3112D]
U13  NUD312D  [NUD3112D]
U14  NUD3112D  [NUD3112D]
U15  NUD3112D  [NUD3112D]
U16  NL17SZ125  (parts A,B of 2)
U17  NL17SZ125  (parts A,B of 2)
U18  NL17SZ125  (parts A,B of 2)
U19  NL17SZ125  (part B of 2)
U20  NL17SZ125  (part B of 2)
U21  NUD3112D  [NUD3112D]
Y2  CB-3 Oscillator  [CB3-16MHZ]
Y3  8MHz  [CeramicResonator8-16MHZ]

### Ports
BatVoltCheck, Ch1V+, Ch2V+, Ch3V+, Ch4V+, Ch5V+, Ch6V+, Ch7V+, Ch8V+, Ch9V+, Ch10V+, ChargerON, ChipSel, ChipSel1, CLK-SPI, CS_4, CS_5, CT7+, CT8+, CT9+, CT10+, ECRSDV, EMDC, Enable, ERXERR, InputVoltCheck, MDIO, MISO, MOSI, MRESET, Phase_N, REFCLK, RxD0, RxD1, SCK, SDI, SDO, SYN, TxD0, TxD1, TxEN, Wake, Xtal2

### Nets
GND: C27.2 C28.2 C29.2 C30.2 C31.2 C32.2 C33.2 C34.1 C36.2 C37.1 C38.2 C39.2 C40.1 C41.1 C42.2 C44.1 C45.1 C46.2 C47.2 C50.2 C51.2 C52.1 C53.2 C56.2 C57.2 C59.2 C60.2 C61.2 C62.2 C63.2 C64.2 C67.2 C69.2 C70.2 C71.2 C72.2 C74.2 C75.2 C77.2 C78.2 C79.2 C80.2 C81.2 C82.2 C86.2 C87.2 C88.2 C89.2 C125.1 D14.2(K) D15.2(K) J7.1 L5.1 L6.1 L8.1 L9.1 L11.1 L12.1 L14.1 L15.1 L17.1 L18.1 L20.1 L21.1 M1.6(MTD) M1.7(GPIO2) M1.9(GND) M1.13(GND) P1.5 P2.11 P2.12 P2.13 P3.11 P3.12 P3.13 P4.4 P4.5 P6.2 P7.2 S1.1 TS1.5(GND) U4.3(XTAL1) U4.18(GND_REF) U4.20(GNDA) U4.22(GND_REG) U4.25(GNDD) U4.26(GNDD) U5.9(VSS) U5.20(AVSS) U5.25(VSS) U5.41(VSS) U6.3(XTAL1) U6.18(GND_REF) U6.20(GNDA) U6.22(GND_REG) U6.25(GNDD) U6.26(GNDD) U7.3(WP) U7.4(GND) U8.3(XTAL1) U8.18(GND_REF) U8.20(GNDA) U8.22(GND_REG) U8.25(GNDD) U8.26(GNDD) U11.1(S1) U11.4(S2) U12.1(S1) U12.4(S2) U13.1(S1) U13.4(S2) U14.1(S1) U14.4(S2) U15.1(S1) U15.4(S2) U16.3 U17.3 U18.3 U19.3 U20.3 U21.1(S1) U21.5(G2) Y2.2(Gnd) Y3.2 Y3.4 ; port Phase_N
VCC=3.3V: C29.1 C30.1 C31.1 C34.2 C37.2 C38.1 C40.2 C41.2 C44.2 C45.2 C56.1 C57.1 C74.1 C75.1 C125.2 J6.2 M1.1(VCC) M1.2(EN) P1.1 P4.1 R59.2 R113.1 R114.1 R115.1 R121.1 TS1.2(Vcc) U4.23(VCC) U5.10(VDD) U5.19(AVDD) U5.26(VDD) U5.38(VDD) U5.57(VDD) U6.23(VCC) U7.8(VCC) U8.23(VCC) U16.5 U17.5 U18.5 U19.5 U20.5 Y2.1(En) Y2.4(Vcc)
VCC=12V: P2.14
NetC27_1: C27.1 C33.1 C39.1 U4.27(VDDD)
NetC28_1: C28.1 C32.1 C36.1 U4.21(VDDA)
NetC35_1: C35.1 R42.1 U4.12(IIN1)
NetC35_2: C35.2 R40.1 TP4.1 U4.11(IIP1)
NetC42_1: C42.1 R46.2 TP11#1.1 U5.40(OSC2) Y3.1
NetC43_1: C43.1 L6.2 R45.2 U4.10(VIN1)
NetC43_2: C43.2 P2.1 R45.1 TP5.1 U4.9(VIP1) ; port Ch1V+
NetC46_1: C46.1 U5.56(VCAP)
NetC47_1: C47.1 R46.1 TP12.1 U5.39(OSC1) Y3.3
NetC48_1: C48.1 R50.1 TP6.1 U4.13(IIN2)
NetC48_2: C48.2 R47.1 U4.14(IIP2)
NetC50_1: C50.1 C52.2 U4.19(VREF)
NetC51_1: C51.1 C53.1 U4.17(VREF1)
NetC54_1: C54.1 L9.2 R53.2 U4.16(VIP2)
NetC54_2: C54.2 P2.2 R53.1 TP7.1 U4.15(VIN2) ; port Ch2V+
NetC59_1: C59.1 C62.1 C63.1 U6.21(VDDA)
NetC60_1: C60.1 C61.1 C64.1 U6.27(VDDD)
NetC65_1: C65.1 R58.1 U6.12(IIN1)
NetC65_2: C65.2 R55.1 TP14.1 U6.11(IIP1)
NetC66_1: C66.1 L12.2 R61.2 U6.10(VIN1)
NetC66_2: C66.2 P2.3 R61.1 TP15.1 U6.9(VIP1) ; port Ch3V+
NetC67_1: C67.1 M1.15(RTS) P1.4 R59.1 U5.7(MCLR) ; port MRESET
NetC68_1: C68.1 R66.1 TP16.1 U6.13(IIN2)
NetC68_2: C68.2 R63.1 U6.14(IIP2)
NetC69_1: C69.1 C71.1 U6.19(VREF)
NetC70_1: C70.1 C72.1 U6.17(VREF1)
NetC73_1: C73.1 L15.2 R72.2 U6.16(VIP2)
NetC73_2: C73.2 P2.4 R72.1 TP17#1.1 U6.15(VIN2) ; port Ch4V+
NetC77_1: C77.1 C79.1 C81.1 U8.27(VDDD)
NetC78_1: C78.1 C80.1 C82.1 U8.21(VDDA)
NetC83_1: C83.1 R77.1 U8.12(IIN1)
NetC83_2: C83.2 R74.1 TP18.1 U8.11(IIP1)
NetC84_1: C84.1 L18.2 R78.2 U8.10(VIN1)
NetC84_2: C84.2 P2.5 R78.1 TP19.1 U8.9(VIP1) ; port Ch5V+
NetC85_1: C85.1 R83.1 TP20.1 U8.13(IIN2)
NetC85_2: C85.2 R80.1 U8.14(IIP2)
NetC86_1: C86.1 C88.1 U8.19(VREF)
NetC87_1: C87.1 C89.1 U8.17(VREF1)
NetC90_1: C90.1 L21.2 R85.2 U8.16(VIP2)
NetC90_2: C90.2 P2.6 R85.1 TP21#1.1 U8.15(VIN2) ; port Ch6V+
NetC101_2: P2.7 ; port Ch7V+
NetC103_2: P2.8 ; port Ch8V+
NetC118_2: P2.9 ; port Ch9V+
NetC120_2: P2.10 ; port Ch10V+
NetD14_1: D14.1(A) R68.2
NetD15_1: D15.1(A) R67.2
NetJ2_1: J2.1 P4.2
NetJ2_2: J2.2 J3.2 M1.12(TxD)
NetJ3_1: J3.1 U5.51(U1TX)
NetJ4_1: J4.1 P4.3
NetJ4_2: J4.2 J5.2 M1.11(RxD)
NetJ5_1: J5.1 U5.50(U1RX)
NetJ6_1: J6.1 J7.2 M1.8(GPIO0)
NetL4_1: L4.1 P3.1
NetL4_2: L4.2 R40.2 R41.2
NetL5_2: L5.2 R41.1 R42.2
NetL7_1: L7.1 P3.2
NetL7_2: L7.2 R47.2 R49.2
NetL8_2: L8.2 R49.1 R50.2
NetL10_1: L10.1 P3.3
NetL10_2: L10.2 R55.2 R57.2
NetL11_2: L11.2 R57.1 R58.2
NetL13_1: L13.1 P3.4
NetL13_2: L13.2 R63.2 R64.2
NetL14_2: L14.2 R64.1 R66.2
NetL16_1: L16.1 P3.5
NetL16_2: L16.2 R74.2 R75.2
NetL17_2: L17.2 R75.1 R77.2
NetL19_1: L19.1 P3.6
NetL19_2: L19.2 R80.2 R82.2
NetL20_2: L20.2 R82.1 R83.2
NetL22_1: P3.7 ; port CT7+
NetL25_1: P3.8 ; port CT8+
NetL28_1: P3.9 ; port CT9+
NetM2_3: U5.43(RD9) ; port Wake
NetM2_5: U5.32(SDO4) U7.5(SI) ; port SDI
NetM2_6: U5.29(SCL4) U7.6(SCLK) ; port SCK
NetM2_7: U5.31(SDI4) U7.2(SO) ; port SDO
NetM2_8: U5.17(RB6/AN6) ; port ChipSel1
NetP1_2: P1.2 U5.15(PGEC1)
NetP1_3: P1.3 U5.16(PGED1)
NetP2_15: P2.15 U11.6(D1)
NetP2_16: P2.16 U11.3(D2)
NetP2_17: P2.17 U12.6(D1)
NetP2_18: P2.18 U12.3(D2)
NetP2_19: P2.19 U13.6(D1)
NetP2_20: P2.20 U13.3(D2)
NetP2_21: P2.21 U14.6(D1)
NetP2_22: P2.22 U14.3(D2)
NetP2_23: P2.23 U15.6(D1)
NetP2_24: P2.24 U15.3(D2)
NetP3_10: P3.10 ; port CT10+
NetP6_1: P6.1 R121.2 S1.2 U5.42(RD8)
NetP7_1: P7.1 U21.6(D1)
NetR3_1: U5.23(RB10/AN10) ; port InputVoltCheck
NetR12_1: U5.22(RB9/An9) ; port BatVoltCheck
NetR13_2: U5.33(USBID/RF3) ; port ChargerON
NetR22_1: U5.49(EMDIO) ; port MDIO
NetR29_2: U5.61(ERXD0) ; port RxD0
NetR30_2: U5.60(ERXD1) ; port RxD1
NetR31_2: U5.62(ERXDIV) ; port ECRSDV
NetR32_2: U5.64(ERXERR) ; port ERXERR
NetR35_2: U5.63(ERXCLK) ; port REFCLK
NetR67_1: R67.1 U5.36(RG3)
NetR68_1: R68.1 U5.28(RB13)
NetR113_2: R113.2 TP26.1 U4.29(SCS) U5.8(RG9) U16.1
NetR114_2: R114.2 TP27.1 U5.11(RB5/AN5) U6.29(SCS) U17.1
NetR115_2: R115.2 TP28.1 U18.1
NetR116_2: U5.14(RB2/AN2) ; port CS_4
NetR117_2: U5.13(RB3/AN3) ; port CS_5
NetTP8_1: TP8.1 U4.30(SCL) U5.4(SCK2) U6.30(SCL) U8.30(SCL) ; port CLK-SPI
NetTP9_1: TP9.1 U4.31(MOSI) U5.6(SDO2) U6.31(MOSI) U8.31(MOSI) ; port MOSI
NetTP10_1: TP10.1 U5.5(SDI2) U16.4(Y) U17.4(Y) U18.4(Y) ; port MISO
NetTP13_1: TP13.1 U4.2(XTAL2) U6.2(XTAL2) U8.2(XTAL2) Y2.3(Out) ; port Xtal2
NetTS1_1: TS1.1(Vout) U5.24(RB11/AN11)
NetU3_13: U5.30(EMDC) ; port EMDC
NetU3_16: U5.1(ETXEN) ; port TxEN
NetU3_17: U5.2(ETXD0) ; port TxD0
NetU3_18: U5.3(ETXD1) ; port TxD1
NetU4_8: U4.8(EN) U6.8(EN) U8.8(EN) ; port Enable
NetU4_28: U4.28(SYN) U5.44(RD10) U6.28(SYN) U8.28(SYN) ; port SYN
NetU4_32: U4.32(MISO) U16.2(B)
NetU5_12: U5.12(RB4/AN4) U8.29(SCS)
NetU5_18: U5.18(RB7/AN7) U15.5(G2)
NetU5_21: U5.21(RB8/AN8) U15.2(G1)
NetU5_27: U5.27(RB12) U7.1(CS)
NetU5_37: U5.37(RG2) ; port ChipSel
NetU5_46: U5.46(OC1) U21.2(G1)
NetU5_47: U5.47(RC13) U14.5(G2)
NetU5_48: U5.48(RC14) U14.2(G1)
NetU5_52: U5.52(RD4) U13.5(G2)
NetU5_53: U5.53(RD5) U13.2(G1)
NetU5_54: U5.54(RD6) U12.5(G2)
NetU5_55: U5.55(RD7) U12.2(G1)
NetU5_58: U5.58(RF0) U11.5(G2)
NetU5_59: U5.59(RF1) U11.2(G1)
NetU6_32: U6.32(MISO) U17.2(B)
NetU8_32: U8.32(MISO) U18.2(B)

Not connected (* = marked no-connect by the designer): U4 1(CLKOUT) 4(LED1) 5(LED2) 6(INT1) 7(INT2) 24(NC); U5 34(VBUS) 35(VUSB) 45(RD11); U6 1(CLKOUT) 4(LED1) 5(LED2) 6(INT1) 7(INT2) 24(NC); U7 7(HOLD); U8 1(CLKOUT) 4(LED1) 5(LED2) 6(INT1) 7(INT2) 24(NC); U21 3(D2) 4(S2)

### Notes on the sheet
- Channel01
- CurrentTrans1+
- (near R40) 1%
- (near R40) .125W
- (near L5) /1%
- /.125W
- (near R42) /1%/.125W
- (near P4) TxD
- (near P4) RxD
- CurrentTrans2+
- Channel02
- (near R47) 1%
- (near R47) .125W
- (near R46) .125W
- (near R46) 1%
- (near L8) /1%
- /1%/.125W
- (near P3) CurrTr1+
- (near L10) CurrentTrans3+
- (near L9) Channel03
- (near R55) 1%
- (near R55) .125W
- (near P3) CurrTr3+
- (near P3) CurrTr4+
- (near P3) CurrTr2+
- (near P3) CurrTr5+
- (near P3) CurrTr6+
- (near L11) /1%
- (near L13) CurrentTrans4+
- 1%
- .125W
- (near L14) /1%
- (near R66) /1%/.125W
- (near R68) .125W
- (near R68) 1%
- (near R67) .125W
- (near R67) 1%
- Status Codes
- CurrentTrans5+
- (near L17) /1%
- CurrentTrans6+
- (near P7) Fan Control
- /1%
- (near R82) /.125W
- (near R80) 1%
- SM-CPU Board
- 1 of 3
- Rv. 0.2

### Library data of the parts
C27 C30 C34 C36-C38 C40 C41 C44 C45 C52 C53 C57 C60 C63 C67 C71 C72 C75 C77 C82 C88 C89 C125 = 0805C-18PF-50V-C0G-JOH: as C9 on sheet CPU-board-Sheet1-multi; Supplier 1: Digi-Key; Supplier Part Number 1: 709-1171-2-ND; Package reference: 0805-TBD; Supplier: Digi-Key; PackageReference: 0402; Price: .002
C28 C46 C59 C64 C78 C81 = Cap: as C7 on sheet CPU-board-Sheet1-multi; Published: 8-Jun-2000; LatestRevisionDate: 17-Jul-2002; LatestRevisionNote: Re-released for DXP Platform.; PackageReference: 0402; Publisher: Altium Limited; PackageDescription: Radial Cap, Thru-Hole; 2 Leads; 0.3 in Pin Spacing; Supplier: DigiKey
C29 C32 C33 C56 C61 C62 C74 C79 C80 = 0805C-18PF-50V-C0G-JOH: CAPACITOR 0805 CERAMIC; Manufacturer: Wurth Electronics; Mfr.PN#: 885012005014; Suppl.PN#: 732-7432-1-ND; Supplier 1: Digi-Key; Supplier Part Number 1: 709-1171-2-ND; Value: 150pF/10V; mfr PN: *; Supplier: Digi-Key; Price: .002
  C29 C33: PackageReference: 0402; smd: 0402
  C32: Package reference: 0805-TBD; smd: 0402
  C56 C61 C62 C74 C79 C80: Package reference: 0805-TBD; PackageReference: 0402
C31 = Cap Pol3: Polarized Capacitor (Surface Mount); Manufacturer: Nichicon; Mfr.PN#: RL80J471MDNASQKX; Value: 100uF/10v; Suppl.PN#: 493-4019-3-ND; Published: 8-Jun-2000; LatestRevisionDate: 29-May-2009; LatestRevisionNote: IPC-7351 Footprint Added.; PackageReference: Radial Can; Publisher: Altium Limited; PackageDescription: Chip Capacitor; Supplier: Digi-Key; SMD: 1206; Price: .065
C35 C43 C48 C54 C65 C66 C68 C73 C83-C85 C90 = 0805C-18PF-50V-C0G-JOH: CAPACITOR 0805 CERAMIC; Manufacturer: Murata Electronics; Mfr.PN#: GRM155R71C103KA01D; Value: 10n; Suppl.PN#: 490-1313-1-ND; Supplier 1: Digi-Key; Supplier Part Number 1: 709-1171-2-ND; mfr PN: *; PackageReference: 0402; Supplier: Digi-Key; Price: .002
  C35 C68 C73 C83-C85 C90: Suppl.PN#: GRM155R71C103KA01D; smd: 0402
  C43 C48 C54 C66: Package reference: 0402; Suppl.PN#: GRM155R71C103KA01D
  C65: Package reference: 0805-TBD
C39 = Cap: Capacitor; Manufacturer: Samsung; Mfr.PN#: CL05A475MO5NUNC; Value: 1uF; Suppl.PN#: 1276-6836-1-ND; Published: 8-Jun-2000; LatestRevisionDate: 17-Jul-2002; LatestRevisionNote: Re-released for DXP Platform.; PackageReference: 0402; Publisher: Altium Limited; PackageDescription: Radial Cap, Thru-Hole; 2 Leads; 0.3 in Pin Spacing; Supplier: DigiKey
C42 = 0805C-18PF-50V-C0G-JOH: CAPACITOR 0805 CERAMIC; Manufacturer: Murata; Mfr.PN#: GRM1555C1E120JA01D; Suppl.PN#: 490-8170-1-ND; Supplier 1: Digi-Key; Supplier Part Number 1: 709-1171-2-ND; Supplier: DigiKey; PackageReference: 0402
C47 = 0805C-18PF-50V-C0G-JOH: CAPACITOR 0805 CERAMIC; Manufacturer: Murata; Mfr.PN#: GRM1555C1E120JA01D; Suppliier: DigiKey; Suppl.PN#: 490-8170-1-ND; Supplier 1: Digi-Key; Supplier Part Number 1: 709-1171-2-ND; PackageReference: 0402
C50 C51 C69 C70 C86 C87 = 0805C-18PF-50V-C0G-JOH: as C17 on sheet CPU-board-Sheet1-multi; Supplier 1: Digi-Key; Supplier Part Number 1: 709-1171-2-ND; mfr PN: *; PackageReference: 0402; Supplier: Digi-Key; smd: 0402; Price: .002
D14 D15 = LED2: as D2 on sheet CPU-board-Sheet1-multi; Published: 8-Jun-2000; LatestRevisionDate: 17-Jul-2002; LatestRevisionNote: Re-released for DXP Platform.; PackageVersion: Feb-2002; PackageReference: 0603; Publisher: Altium Limited; PackageDescription: SM LED; 2 Flat Leads; Supplier: Digi-Key; Price: .04
J2-J7 = Header1x1: Suppl.PN#: S9014E-05-ND; Supplier: Digikey
L4-L21 = FerrBeads/ILBB: Manufacturer: Brand Samsung; Mfr.PN#: C1M10J152NC; Suppl.PN#: 1276-6326-1-ND; Supplier: Digi-Key; Price: .027
  L4-L7: PackageReference: 0603
M1 = ESP 8266: Supplier: Alixpress; Suppl.PN#: ESP8266-WROOM-02; Link: https://www.aliexpress.com/store/product/ESP8266-serial-WIFI-model-ESP-WROOM-02-Authenticity-Guaranteed/431798_32319251013.html
P1 P4 = Header 5: Header, 5-Pin; Suppl.PN#: S9014E-05-ND; LatestRevisionDate: 17-Jul-2002; LatestRevisionNote: Re-released for DXP Platform.; Publisher: Altium Limited; Supplier: Optional depend of debugger; Supplier: Digikey
P2 = Header 24: Header, 24-Pin; Manufacturer: Sullins Connector Solution; Mfr.PN#: PPPC241LFBN-RC; Suppl.PN#: S7057-ND; LatestRevisionDate: 17-Jul-2002; LatestRevisionNote: Re-released for DXP Platform.; Publisher: Altium Limited; Supplier: Digikey
P3 = Header 13: Header, 13-Pin; Mfr.PN#: PPPC131LFBN-RC; Manufacturer: Sullins Connector Solution; Suppl.PN#: S7046-ND; LatestRevisionNote: Re-released for DXP Platform.; Publisher: Altium Limited; Supplier: Digikey
P6 P7 = Header 2: Header, 2-Pin; Suppl.PN#: S9014E-05-ND; LatestRevisionDate: 17-Jul-2002; LatestRevisionNote: Re-released for DXP Platform.; Publisher: Altium Limited; Supplier: Digikey
R40 R42 R47 R50 R55 R58 R63 R66-R68 R74 R77 R80 R83 = Res3: as R38 on sheet CPU-board-Sheet1-multi; Published: 8-Jun-2000; LatestRevisionDate: 29-May-2009; LatestRevisionNote: IPC-7351 Footprint Added.; PackageReference: 0402; Publisher: Altium Limited; PackageDescription: Chip Resistor; Supplier: DigiKey; Price: .0035
R41 R49 R57 R64 R75 R82 = Res3: Resistor; Manufacturer: Vishay Dale; Mfr.PN#: CRCW04026R20FKED; Value: 18.7 1%; Suppl.PN#: 541-6.20LLCT-ND; Published: 8-Jun-2000; LatestRevisionDate: 29-May-2009; LatestRevisionNote: IPC-7351 Footprint Added.; PackageReference: 0402; Publisher: Altium Limited; PackageDescription: Chip Resistor; Supplier: Digi-Key; Price: .05; SMD: 0402
R45 R53 R61 R72 R78 R85 = Res3: Resistor; Manufacturer: Vishay/Draloric; Mfr.PN#: SMM02040C4700FB300; Value: 470 1%/.250W; Suppl.PN#: 71-SMM0204-F-470; Published: 8-Jun-2000; LatestRevisionDate: 29-May-2009; LatestRevisionNote: IPC-7351 Footprint Added.; Publisher: Altium Limited; PackageDescription: Chip Resistor; Supplier: Mouser; SMD: 1206; Price: .02; PackageReference: 1206
R46 = Res3: Resistor; Manufacturer: Panasonic; Mfr.PN#: ERJ-2RKF1004X; Value: 1K 1%; Suppl.PN#: P1.00MLTR-ND; Published: 8-Jun-2000; LatestRevisionDate: 29-May-2009; LatestRevisionNote: IPC-7351 Footprint Added.; PackageReference: 0402; Publisher: Altium Limited; PackageDescription: Chip Resistor; manufacture P/N: *; Supplier: Digi-Key; Price: .0027
R59 R121 = Res3: as R13 on sheet CPU-board-Sheet1-multi; Published: 8-Jun-2000; LatestRevisionDate: 29-May-2009; LatestRevisionNote: IPC-7351 Footprint Added.; PackageReference: 0402; Publisher: Altium Limited; PackageDescription: Chip Resistor; Supplier: Digi-Key; Price: .0035
R113 = Res3: Resistor; Manufacturer: Panasonic; Mfr.PN#: ERJ-2RKF1002X; Value: 10k; Suppl.PN#: P10.0KLCT-ND; Published: 8-Jun-2000; LatestRevisionDate: 29-May-2009; LatestRevisionNote: IPC-7351 Footprint Added.; Publisher: Altium Limited; PackageDescription: Chip Resistor; Supplier: Digikey; SMD: 0402; Price: .02; PackageReference: 0402
R114 = Res3: Resistor; Manufacturer: Panasonic; Mfr.PN#: ERJ-2RKF1002X; Suppl.PN#: P10.0KLCT-ND; Published: 8-Jun-2000; LatestRevisionDate: 29-May-2009; LatestRevisionNote: IPC-7351 Footprint Added.; Publisher: Altium Limited; PackageDescription: Chip Resistor; Value: 10k; Supplier: Digikey; SMD: 0402; Price: .02; PackageReference: 0402
R115 = Res3: Resistor; Manufacturer: Panasonic; Mfr.PN#: ERJ-2RKF1002X; Value: 10k/1%/.125W; Suppl.PN#: P10.0KLCT-ND; Published: 8-Jun-2000; LatestRevisionDate: 29-May-2009; LatestRevisionNote: IPC-7351 Footprint Added.; Publisher: Altium Limited; PackageDescription: Chip Resistor; Supplier: Digikey; SMD: 0402; Price: .02; PackageReference: 0402
S1 = SW-PB: Switch; Manufacturer: Digibay; Mfr.PN#: SE-DE01-09-0157; Published: 24-Mar-1999; LatestRevisionDate: 17-Jul-2002; LatestRevisionNote: Re-released for DXP Platform.; PackageReference: SPST-2; Publisher: Altium Limited; PackageDescription: Switch; 2 Leads; Link: http://www.digibay.in/157-smd-tactile-micro-push-button-switch
TP4-TP10 TP11#1 TP12-TP16 TP17#1 TP18-TP20 TP21#1 TP26-TP28 = TESTPOINT: as TP1 on sheet CPU-board-Sheet1-multi; Supplier 1: Digi-Key; Supplier Part Number 1: 5010K-ND
TS1 = PTC TPM37: Manufacturer: Analog Devices; Mfr.PN#: TMP37GRTZ-REEL7; Suppl.PN#: TMP37GRTZ-REEL7CT-ND; Supplier: Digikey
U4 = STPM34: Manufacturer: STMicroelectronics; Mfr.PN#: STPM34TR; Suppl.PN#: 497-14670-1-ND; ReferencePackage: QFN32; Supplier: DigiKey
U5 = PIC32MX534F064F: Manufacturer: Microchip; Mfr.PN#: PIC32MX795F512H-80I/PT; Suppl.PN#: PIC32MX795F512H-80I/PT-ND; Supplier: Digikey
U7 = 23LCV1024: Manufacturer: Winbond Electronics; Mfr.PN#: W25Q16DVZPIG; Suppl.PN#: W25Q16DVZPIG-ND; Supplier: DigiKey; PackageReference: 8-SOIC
U11-U15 U21 = NUD312D: Manufacturer: On Semi; Mfr.PN#: NUD3112DMT1G; Suppl.PN#: NUD3112DMT1GOSCT-ND; Supplier: Digikey
U16-U18 = NL17SZ125: Tristate Single Buffer; Manufacturer: ON Semi; Mfr.PN#: NL17SZ125DTT1G; Suppl.PN#: NL17SZ125DTT1GOSCT-ND; Supplier: Digikey; Footprint: TSOP-5 case 483
U19 U20 = NL17SZ125: Tristate Single Buffer
Y2 = CB-3 Oscillator: Manufacturer: CTS Electronics Component; Mfr.PN#: CB 3 LV-31-16M000; Suppl.PN#: CTX947LVCT-ND; Supplier: DigiKey
Y3 = 12MC-HC49US-7MM: 12MHz CRYSTAL HC49US SHORT BODY; Manufacturer: KDS DAISHINKU.Corp; Mfr.PN#: DSX321G-8MHz; Supplier 1: Mouser; Supplier Part Number 1: 520-120-20-3XT; Supplier: KDS DAISHINKU.Corp; Suppl.PN#: DSX321G-8MHz